# EAGLE schematic FM-Radio-Receiver-1.5V (EAGLE 7.2.0)
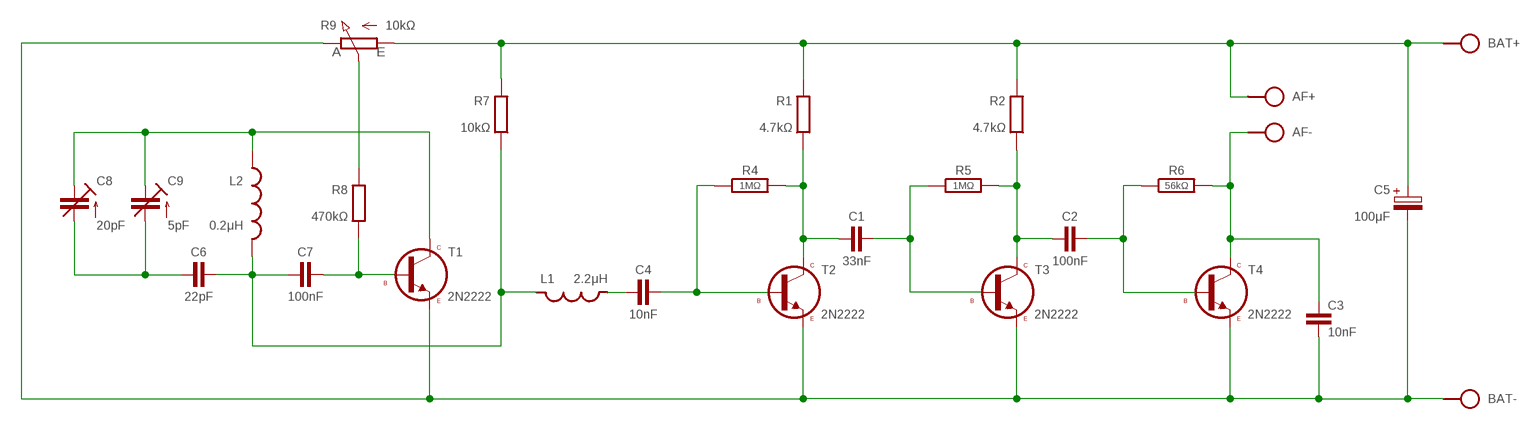
[diagram p0: schematic, sheet 1]

## Parts
AF  SPAD+-+-  [SPAD+-]
BAT  SPAD+-+-  [SPAD+-]
C1  33nF  C-H050-020X044  [C050-020X044]
C2  100nF  C-H050-020X044  [C050-020X044]
C3  10nF  C025-025X060  [C050-025X060]
C4  10nF  C-H050-020X044  [C050-020X044]
C5  100μF  CPOLE2,5-4/V  [E2.5-4/V]
C6  22pF  C-H050-020X036  [C050-020X036]
C7  100nF  C-H075-020X044  [C075-020X044]
C8  20pF  C-TR-PH201272222-808-2PIND  [TRIM-2222-808]
C9  5pF  C-TR-PH20127-TZ03  [CTRIMTZ03]
L1  2.2μH  L-H-SHORT-03/10  [L-03/10]
L2  0.2μH  L10/10Y  [L-10/10Y]
R1  4.7kΩ  R0204/10-V  [0204/10-V]
R2  4.7kΩ  R0204/10-V  [0204/10-V]
R4  1MΩ  R-H0204/10-V  [0204/10-V]
R5  1MΩ  R-H0204/10-V  [0204/10-V]
R6  56kΩ  R-H0204/10-V  [0204/10-V]
R7  10kΩ  R0204/10-V  [0204/10-V]
R8  470kΩ  R0204/10-V  [0204/10-V]
R9  10kΩ  POT-H-3P  [CONN-3P]
T1  2N2222  [TO92]
T2  2N2222  [TO92]
T3  2N2222  [TO92]
T4  2N2222  [TO92]

## Nets
N$1: C1.2 R5.1 T3.2(B)
N$2: C2.1 R2.2 R5.2 T3.3(C)
N$3: C1.1 R1.2 R4.2 T2.3(C)
N$4: C2.2 R6.1 T4.2(B)
N$5: AF.1 C3.1 R6.2 T4.3(C)
N$7: C4.2 R4.1 T2.2(B)
N$8: C4.1 L1.1
N$10: AF.2 BAT.2 C5.+ R1.1 R2.1 R7.1 R9.1(A)
N$11: C7.2 R8.2 T1.2(B)
N$12: R8.1 R9.2(S)
N$13: C8.3(E) C9.2(E) L2.P$1 T1.3(C)
N$14: C6.2 C7.1 L1.2 L2.P$2 R7.2
N$15: C6.1 C8.2(A) C9.1(A)
N$16: BAT.1 C3.2 C5.- R9.3(E) T1.1(E) T2.1(E) T3.1(E) T4.1(E)

## Library data of the parts
AF BAT = pad:SPAD+-
C1 C2 C4 C6 C7 = c:C-H
C3 = c:C: CAPACITOR, European symbol
C5 = c:CPOL: POLARIZED CAPACITOR, European symbol
C8 C9 = cap-trim:C-TR-PH20127
L1 = l:L-H-SHORT
L2 = l:L: Potentiometers Beckman, Copal, Piher, Spectrol, Schukat Created by librarian@cadsoft.de
R1 R2 R7 R8 = r:R: RESISTOR, European symbol
R4-R6 = r:R-H
R9 = r:POT-H
T1-T4 = t:2N2222